# Altium schematic sheet jfino-hw.SchDoc: jfino-hw
size A3; ApprovedBy: ???; Author: ???; Revision: 1.0 2017; SheetNumber: 1; SheetTotal: 1
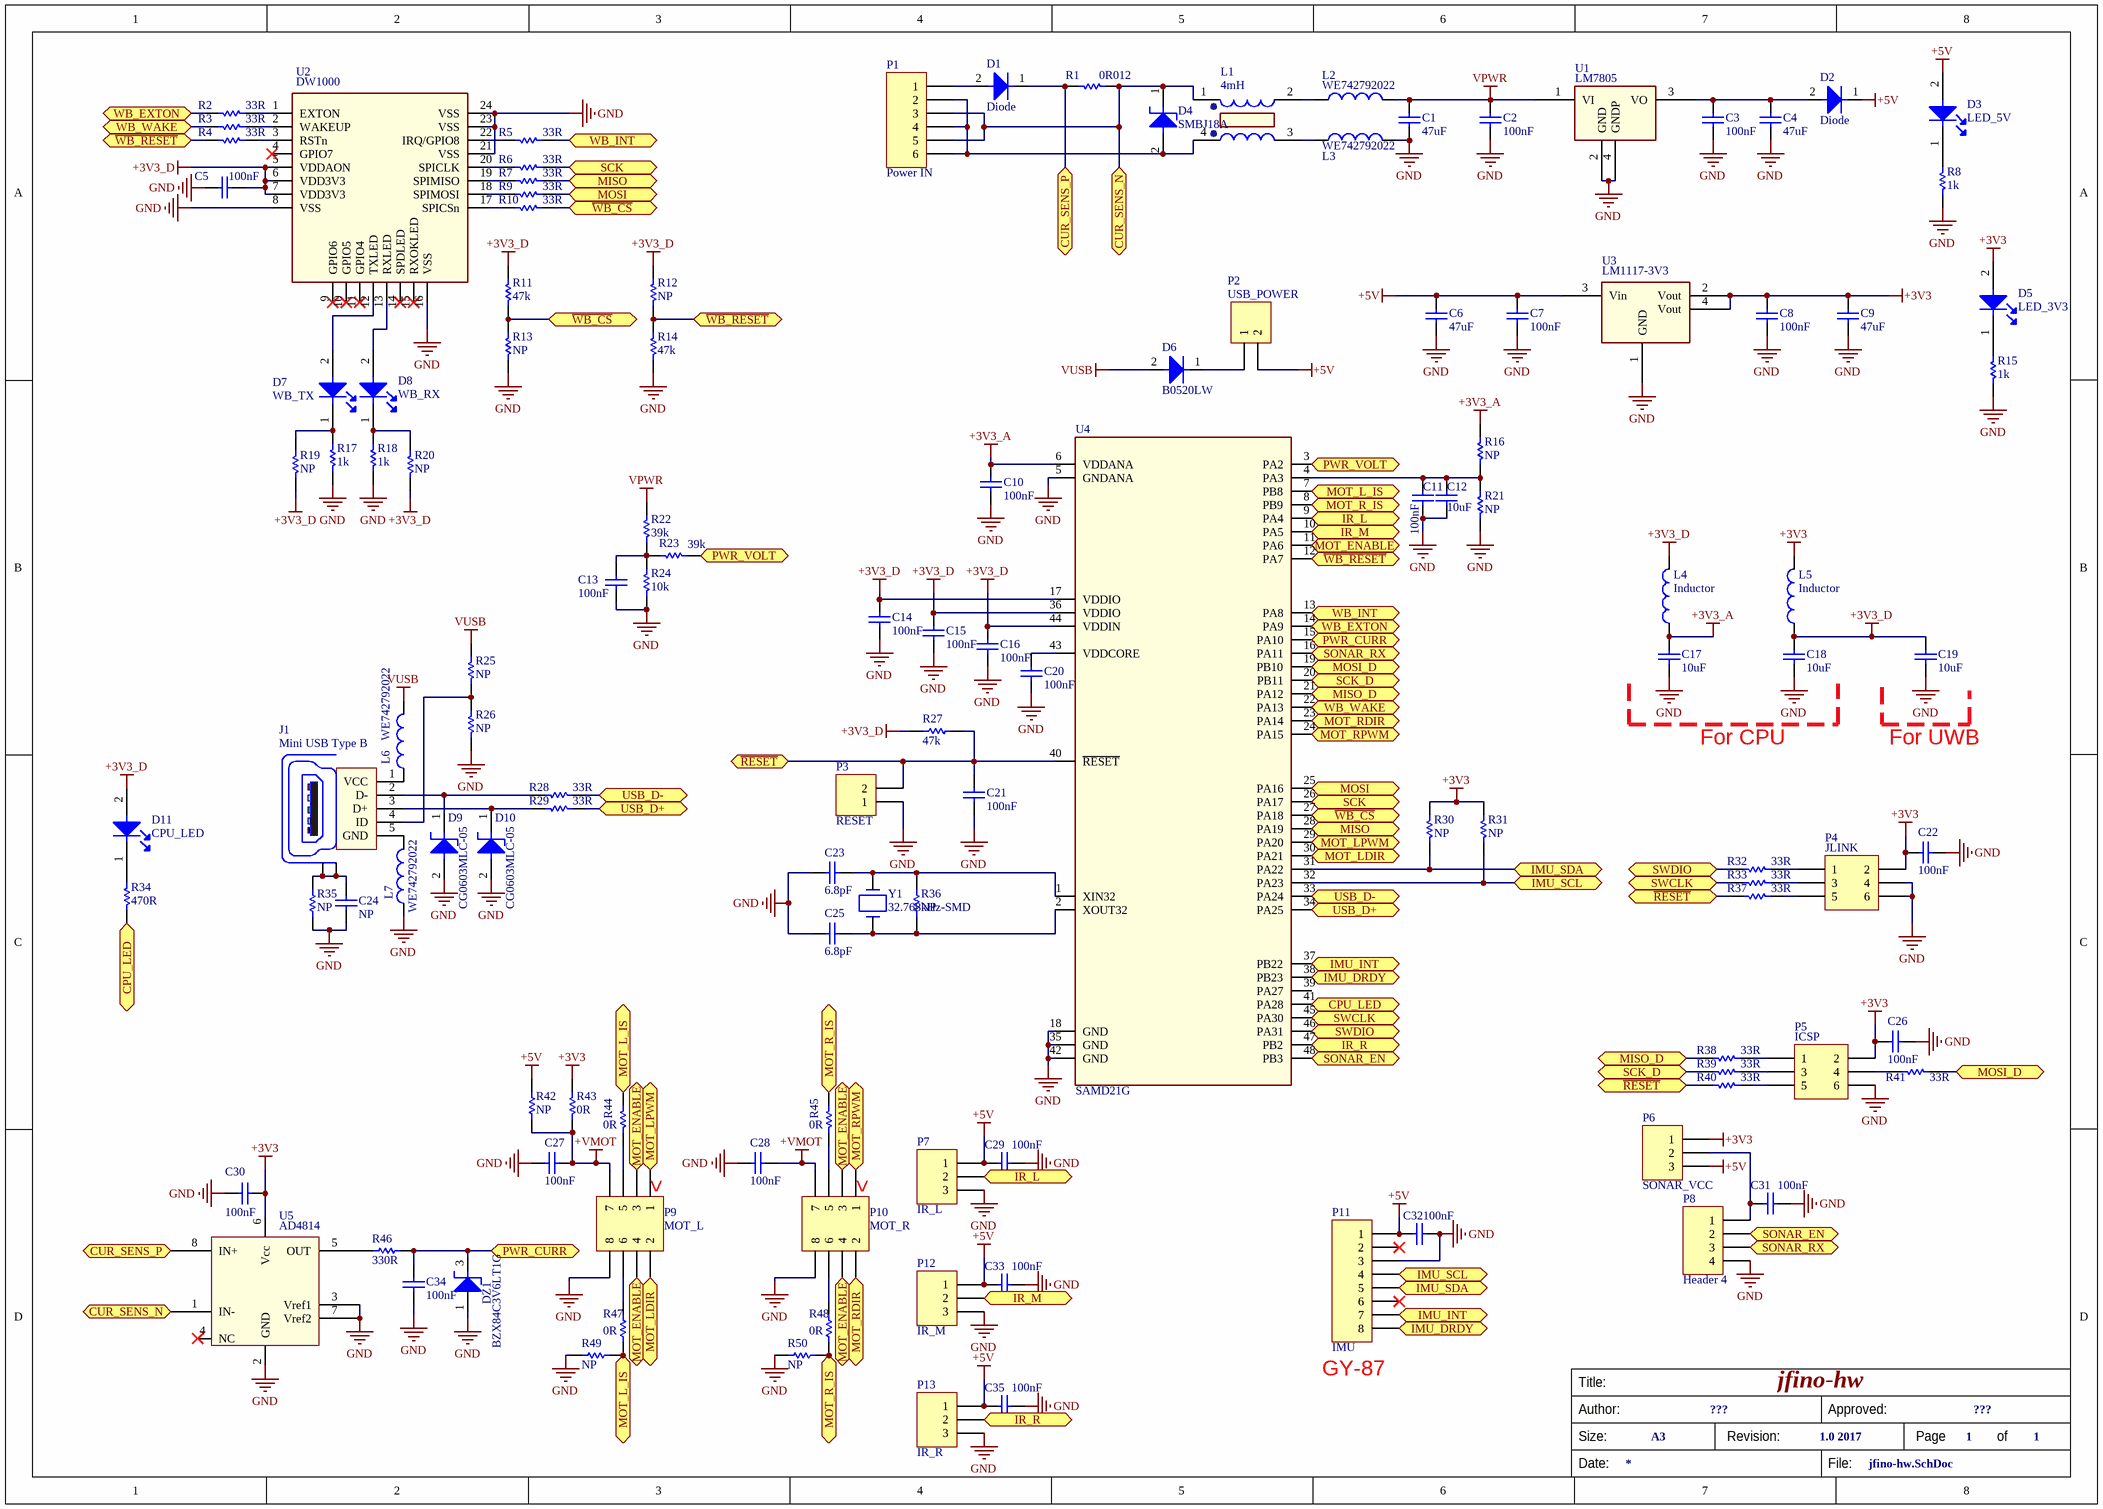
[diagram p0: jfino-hw.SchDoc]

## Parts
C1  47uF  [1206_[3216]]
C2  100nF  [0603_[1608]]
C3  100nF  [0603_[1608]]
C4  47uF  [1206_[3216]]
C5  100nF  [0603_[1608]]
C6  47uF  [1206_[3216]]
C7  100nF  [0603_[1608]]
C8  100nF  [0603_[1608]]
C9  47uF  [1206_[3216]]
C10  100nF  [0603_[1608]]
C11  100nF  [0603_[1608]]
C12  10uF  [1206_[3216]]
C13  100nF  [0603_[1608]]
C14  100nF  [0603_[1608]]
C15  100nF  [0603_[1608]]
C16  100nF  [0603_[1608]]
C17  10uF  [1206_[3216]]
C18  10uF  [1206_[3216]]
C19  10uF  [1206_[3216]]
C20  100nF  [0603_[1608]]
C21  100nF  [0603_[1608]]
C22  100nF  [0603_[1608]]
C23  6.8pF  [0603_[1608]]
C24  NP  [1808_[4520]]
C25  6.8pF  [0603_[1608]]
C26  100nF  [0603_[1608]]
C27  100nF  [0603_[1608]]
C28  100nF  [0603_[1608]]
C29  100nF  [0603_[1608]]
C30  100nF  [0603_[1608]]
C31  100nF  [0603_[1608]]
C32  100nF  [0603_[1608]]
C33  100nF  [0603_[1608]]
C34  100nF  [0603_[1608]]
C35  100nF  [0603_[1608]]
D1  Diode  [0603_[1608]_K1-A2_LED]
D2  Diode  [0603_[1608]_K1-A2_LED]
D3  LED_5V  [0603_[1608]_K1-A2_LED]
D4  SMBJ18A  [DO214AA_K1-A2_SMB]
D5  LED_3V3  [0603_[1608]_K1-A2_LED]
D6  B0520LW  [SOD-123]
D7  WB_TX  [0603_[1608]_K1-A2_LED]
D8  WB_RX  [0603_[1608]_K1-A2_LED]
D9  CG0603MLC-05  [0603_[1608]]
D10  CG0603MLC-05  [0603_[1608]]
D11  CPU_LED  [0603_[1608]_K1-A2_LED]
DZ1  BZX84C3V6LT1G  [SOT-23]
J1  Mini USB Type B  [USB_MICRO_B_SMD]
L1  4mH  [WE-CMB-XS]
L2  WE742792022  [0805_[2012]]
L3  WE742792022  [0805_[2012]]
L4  Inductor  [0805_[2012]]
L5  Inductor  [0805_[2012]]
L6  WE742792022  [0805_[2012]]
L7  WE742792022  [0805_[2012]]
P1  Power IN  [HDR1X6]
P2  USB_POWER  [HEADER_1X2_2.54MM_THD]
P3  RESET  [HEADER_1X2_2.54MM_THD]
P4  JLINK  [HEADER_2X3_2.54MM_THD]
P5  ICSP  [HEADER_2X3_2.54MM_THD]
P6  SONAR_VCC  [HEADER_2X4_2.54MM_THD]
P7  IR_L  [HEADER_2X4_2.54MM_THD]
P8  Header 4  [HEADER_1X4_2.54MM_THD]
P9  MOT_L  [HEADER_2X4_2.54MM_THD]
P10  MOT_R  [HEADER_2X4_2.54MM_THD]
P11  IMU  [HEADER_1X8_2.54MM_THD]
P12  IR_M  [HEADER_2X4_2.54MM_THD]
P13  IR_R  [HEADER_2X4_2.54MM_THD]
R1  0R012  [1206_[3216]]
R2  33R  [0603_[1608]]
R3  33R  [0603_[1608]]
R4  33R  [0603_[1608]]
R5  33R  [0603_[1608]]
R6  33R  [0603_[1608]]
R7  33R  [0603_[1608]]
R8  1k  [0603_[1608]]
R9  33R  [0603_[1608]]
R10  33R  [0603_[1608]]
R11  47k  [0603_[1608]]
R12  NP  [0603_[1608]]
R13  NP  [0603_[1608]]
R14  47k  [0603_[1608]]
R15  1k  [0603_[1608]]
R16  NP  [0603_[1608]]
R17  1k  [0603_[1608]]
R18  1k  [0603_[1608]]
R19  NP  [0603_[1608]]
R20  NP  [0603_[1608]]
R21  NP  [0603_[1608]]
R22  39k  [0603_[1608]]
R23  39k  [0603_[1608]]
R24  10k  [0603_[1608]]
R25  NP  [0603_[1608]]
R26  NP  [0603_[1608]]
R27  47k  [0603_[1608]]
R28  33R  [0603_[1608]]
R29  33R  [0603_[1608]]
R30  NP  [0603_[1608]]
R31  NP  [0603_[1608]]
R32  33R  [0603_[1608]]
R33  33R  [0603_[1608]]
R34  470R  [0603_[1608]]
R35  NP  [0805_[2012]]
R36  NP  [0603_[1608]]
R37  33R  [0603_[1608]]
R38  33R  [0603_[1608]]
R39  33R  [0603_[1608]]
R40  33R  [0603_[1608]]
R41  33R  [0603_[1608]]
R42  NP  [0603_[1608]]
R43  0R  [0603_[1608]]
R44  0R  [0603_[1608]]
R45  0R  [0603_[1608]]
R46  330R  [0603_[1608]]
R47  0R  [0603_[1608]]
R48  0R  [0603_[1608]]
R49  NP  [0603_[1608]]
R50  NP  [0603_[1608]]
U1  LM7805  [SOT-223]
U2  DW1000  [DWM1000]
U3  LM1117-3V3  [SOT-223]
U4  SAMD21G  [LQFP-48_7x7MM_0.5MM]
U5  AD4814  [MSOP8]
Y1  32.768kHz-SMD  [CRYSTAL_4X1.5MM_2P_SMD]

## Ports
CPU_LED (bidir), CUR_SENS_N (bidir), CUR_SENS_P (bidir), IMU_DRDY (bidir), IMU_INT (bidir), IMU_SCL (bidir), IMU_SDA (bidir), IR_L (bidir), IR_M (bidir), IR_R (bidir), MISO (bidir), MISO_D (bidir), MOSI (bidir), MOSI_D (bidir), MOT_ENABLE (bidir), MOT_L_IS (bidir), MOT_LDIR (bidir), MOT_LPWM (bidir), MOT_R_IS (bidir), MOT_RDIR (bidir), MOT_RPWM (bidir), PWR_CURR (bidir), PWR_VOLT (bidir), SCK (bidir), SCK_D (bidir), SONAR_EN (bidir), SONAR_RX (bidir), SWCLK (bidir), SWDIO (bidir), USB_D+ (bidir), USB_D- (bidir), WB_EXTON (bidir), WB_INT (bidir), WB_WAKE (bidir), ~{RESET} (bidir), ~{WB_CS} (bidir), ~{WB_RESET} (bidir)

## Nets
+3V3: C8.2 C9.2 C22.1 C26.1 C30.1 D5.2(A) L5.2 P4.2 P5.2 P6.1 R30.2 R31.2 R43.2 U3.2(Vout) U3.4(Vout) U5.6(Vcc)
+3V3_A: C10.2 C17.2 L4.1 R16.2 U4.6(VDDANA)
+3V3_D: C5.2 C14.2 C15.2 C16.2 C18.2 C19.2 D11.2(A) L4.2 L5.1 R11.2 R12.2 R19.1 R20.1 R27.2 U2.5(VDDAON) U2.6(VDD3V3) U2.7(VDD3V3) U4.17(VDDIO) U4.36(VDDIO) U4.44(VDDIN)
+5V: C6.2 C7.2 C29.1 C32.1 C33.1 C35.1 D2.1(K) D3.2(A) P2.2 P6.3 P7.1 P11.1 P12.1 P13.1 R42.2 U3.3(Vin)
+VMOT: C27.1 C28.1 P9.7 P10.7 R42.1 R43.1
GND: C1.1 C2.1 C3.1 C4.1 C5.1 C6.1 C7.1 C8.1 C9.1 C10.1 C11.1 C12.1 C13.1 C14.1 C15.1 C16.1 C17.1 C18.1 C19.1 C20.1 C21.1 C22.2 C23.2 C24.1 C25.2 C26.2 C27.2 C28.2 C29.2 C30.2 C31.2 C32.2 C33.2 C34.2 C35.2 D9.2 D10.2 DZ1.1(A) L3.2 L7.1 P3.1 P4.4 P4.6 P5.6 P7.3 P8.4 P9.8 P10.8 P11.3 P12.3 P13.3 R8.1 R13.2 R14.2 R15.1 R17.1 R18.1 R21.1 R24.1 R26.1 R35.2 R49.1 R50.1 U1.2(GND) U1.4(GNDP) U2.8(VSS) U2.16(VSS) U2.21(VSS) U2.23(VSS) U2.24(VSS) U3.1(GND) U4.5(GNDANA) U4.18(GND) U4.35(GND) U4.42(GND) U5.2(GND) U5.3(Vref1) U5.7(Vref2)
VPWR: C1.2 C2.2 L2.2 R22.2 U1.1(VI)
VUSB: D6.2(A) L6.2 R25.2
~{RESET}: C21.2 P3.2 R27.1 R37.1 R40.1 U4.40(~{RESET}) ; port ~{RESET}
~{WB_CS}: R10.2 R11.1 R13.1 U4.27(PA18) ; port ~{WB_CS}
~{WB_RESET}: R4.1 R12.1 R14.1 U4.12(PA7) ; port ~{WB_RESET}
CPU_LED: R34.1 U4.41(PA28) ; port CPU_LED
CUR_SENS_N: D4.1 L1.1 P1.3 P1.5 R1.1 U5.1(IN-) ; port CUR_SENS_N
CUR_SENS_P: D1.1(K) R1.2 U5.8(IN+) ; port CUR_SENS_P
IMU_DRDY: P11.8 U4.38(PB23) ; port IMU_DRDY
IMU_INT: P11.7 U4.37(PB22) ; port IMU_INT
IMU_SCL: P11.4 R31.1 U4.32(PA23) ; port IMU_SCL
IMU_SDA: P11.5 R30.1 U4.31(PA22) ; port IMU_SDA
IR_L: P7.2 U4.9(PA4) ; port IR_L
IR_M: P12.2 U4.10(PA5) ; port IR_M
IR_R: P13.2 U4.47(PB2) ; port IR_R
MISO: R7.2 U4.28(PA19) ; port MISO
MISO_D: R38.1 U4.21(PA12) ; port MISO_D
MOSI: R9.2 U4.25(PA16) ; port MOSI
MOSI_D: R41.2 U4.19(PB10) ; port MOSI_D
MOT_ENABLE: P9.3 P9.4 P10.3 P10.4 U4.11(PA6) ; port MOT_ENABLE
MOT_L_IS: R44.2 R47.2 R49.2 U4.7(PB8) ; port MOT_L_IS
MOT_LDIR: P9.2 U4.30(PA21) ; port MOT_LDIR
MOT_LPWM: P9.1 U4.29(PA20) ; port MOT_LPWM
MOT_R_IS: R45.2 R48.2 R50.2 U4.8(PB9) ; port MOT_R_IS
MOT_RDIR: P10.2 U4.23(PA14) ; port MOT_RDIR
MOT_RPWM: P10.1 U4.24(PA15) ; port MOT_RPWM
PWR_CURR: C34.1 DZ1.3(K) R46.2 U4.15(PA10) ; port PWR_CURR
PWR_VOLT: R23.1 U4.3(PA2) ; port PWR_VOLT
SCK: R6.2 U4.26(PA17) ; port SCK
SCK_D: R39.1 U4.20(PB11) ; port SCK_D
SONAR_EN: P8.2 U4.48(PB3) ; port SONAR_EN
SONAR_RX: P8.3 U4.16(PA11) ; port SONAR_RX
SWCLK: R33.1 U4.45(PA30) ; port SWCLK
SWDIO: R32.1 U4.46(PA31) ; port SWDIO
USB_D+: R29.2 U4.34(PA25) ; port USB_D+
USB_D-: R28.2 U4.33(PA24) ; port USB_D-
WB_EXTON: R2.1 U4.14(PA9) ; port WB_EXTON
WB_INT: R5.2 U4.13(PA8) ; port WB_INT
WB_WAKE: R3.1 U4.22(PA13) ; port WB_WAKE
NetC3_2: C3.2 C4.2 D2.2(A) U1.3(VO)
NetC11_2: C11.2 C12.2 R16.1 R21.2 U4.4(PA3)
NetC13_2: C13.2 R22.1 R23.2 R24.2
NetC20_2: C20.2 U4.43(VDDCORE)
NetC23_1: C23.1 R36.1 U4.1(XIN32) Y1.2
NetC24_2: C24.2 J1.Z1(Shield) J1.Z2(Shield) R35.1
NetC25_1: C25.1 R36.2 U4.2(XOUT32) Y1.1
NetC31_1: C31.1 P6.2 P8.1
NetD1_2: D1.2(A) P1.1
NetD3_1: D3.1(K) R8.2
NetD4_2: D4.2 L1.4 P1.2 P1.4 P1.6
NetD5_1: D5.1(K) R15.2
NetD6_1: D6.1(K) P2.1
NetD7_1: D7.1(K) R17.2 R19.2
NetD7_2: D7.2(A) U2.12(TXLED)
NetD8_1: D8.1(K) R18.2 R20.2
NetD8_2: D8.2(A) U2.13(RXLED)
NetD9_1: D9.1 J1.2(D-) R28.1
NetD10_1: D10.1 J1.3(D+) R29.1
NetD11_1: D11.1(K) R34.2
NetJ1_1: J1.1(VCC) L6.1
NetJ1_4: J1.4(ID) R25.1 R26.2
NetJ1_5: J1.5(GND) L7.2
NetL1_2: L1.2 L2.1
NetL1_3: L1.3 L3.1
NetP4_1: P4.1 R32.2
NetP4_3: P4.3 R33.2
NetP4_5: P4.5 R37.2
NetP5_1: P5.1 R38.2
NetP5_3: P5.3 R39.2
NetP5_4: P5.4 R41.1
NetP5_5: P5.5 R40.2
NetP9_5: P9.5 R44.1
NetP9_6: P9.6 R47.1
NetP10_5: P10.5 R45.1
NetP10_6: P10.6 R48.1
NetR2_2: R2.2 U2.1(EXTON)
NetR3_2: R3.2 U2.2(WAKEUP)
NetR4_2: R4.2 U2.3(RSTn)
NetR5_1: R5.1 U2.22(IRQ/GPIO8)
NetR6_1: R6.1 U2.20(SPICLK)
NetR7_1: R7.1 U2.19(SPIMISO)
NetR9_1: R9.1 U2.18(SPIMOSI)
NetR10_1: R10.1 U2.17(SPICSn)
NetR46_1: R46.1 U5.5(OUT)

Not connected (* = marked no-connect by the designer): P11 2* 6*; U2 4(GPIO7)* 9(GPIO6)* 10(GPIO5)* 11(GPIO4)* 14(SPDLED)* 15(RXOKLED)*; U4 39(PA27); U5 4(NC)*

## Notes on the sheet
- For CPU
- For UWB
- (near P9) <
- (near P10) <
- (near P11) GY-87
- Title:
- Author:
- Size:
- Date:
- A3
- Revision:
- File:
- Approved:
- Page
- of

## Library data of the parts
C1-C35 = Cap: Capacitor; Value: 10nF; Published: 8-Jun-2000; Revision: July-2002: Re-released for DXP Platform.; Publisher: Altium Limited
D1 = Diode: 10A
D3 D5 D7 D8 D11 = LED: Multicolor LED
D4 D9 D10 = TVS
D6 = Diode
DZ1 = ZENER_BZX
J1 = USB_Con_Type_B_mini_THD_vert: Mini USB THD Type B 5 Contacts Vertical; Manufacturer: Würth Elektronik eiSos GmbH; partNo: 65100516121; ComponentLink1 Description: Manufacturer; ComponentLink2 Description: Datasheet; NoPins: 5; ComponentLink1URL: http://www.we-online.de; ComponentLink2URL: http://katalog.we-online.de/em/datasheet/65100516121.pdf; Created by: Karrer Zheng; Created Date: 10/10/2014
L1 = Common_mode_choke: WE 744821240
L2 L3 L6 L7 = Inductor
P1 = Header 6: Header, 6-Pin; LatestRevisionDate: 17-Jul-2002; LatestRevisionNote: Re-released for DXP Platform.; Publisher: Altium Limited
P2 P3 = Header 2: Header, 2-Pin; LatestRevisionDate: 17-Jul-2002; LatestRevisionNote: Re-released for DXP Platform.; Publisher: Altium Limited
P4 P5 = Header 3X2: Header, 3-Pin, Dual row; LatestRevisionDate: 17-Jul-2002; LatestRevisionNote: Re-released for DXP Platform.; Publisher: Altium Limited
P6 P7 P12 P13 = Header 3: Header, 3-Pin; LatestRevisionDate: 17-Jul-2002; LatestRevisionNote: Re-released for DXP Platform.; Publisher: Altium Limited
P8 = Header 4: Header, 4-Pin; LatestRevisionDate: 17-Jul-2002; LatestRevisionNote: Re-released for DXP Platform.; Publisher: Altium Limited
P9 P10 = Header 4X2: Header, 4-Pin, Dual row; LatestRevisionDate: 17-Jul-2002; LatestRevisionNote: Re-released for DXP Platform.; Publisher: Altium Limited
P11 = Header 8: Header, 8-Pin; LatestRevisionDate: 17-Jul-2002; LatestRevisionNote: Re-released for DXP Platform.; Publisher: Altium Limited
R1-R7 R9-R14 R16 R19-R50 = Res1: Resistor; Value: 1K; Published: 8-Jun-2000; Revision: July-2002: Re-released for DXP Platform.; Publisher: Altium Limited
R8 R15 R17 R18 = Res1: Resistor; Published: 8-Jun-2000; Revision: July-2002: Re-released for DXP Platform.; Publisher: Altium Limited; Value: 1K
U3 = LM1117-FIXED-OUT: LM1117 LDO Fixed output
U5 = AD8414: Shunt current monitor
Y1 = 32.768kHz-SMD: Crystal 32.768kHz SMD 2-Pin; Part Number: Aker C2E-24.000-12-3030-X; Purchase Code: RS 671-9564
U1 = LM7805: case: THD